# Altium schematic sheet Camera.SchDoc
size A3; Author: Nguyễn Hữu Thắng; DrawnBy: Nguyễn Hữu Thắng; SheetNumber: 30; SheetTotal: 35
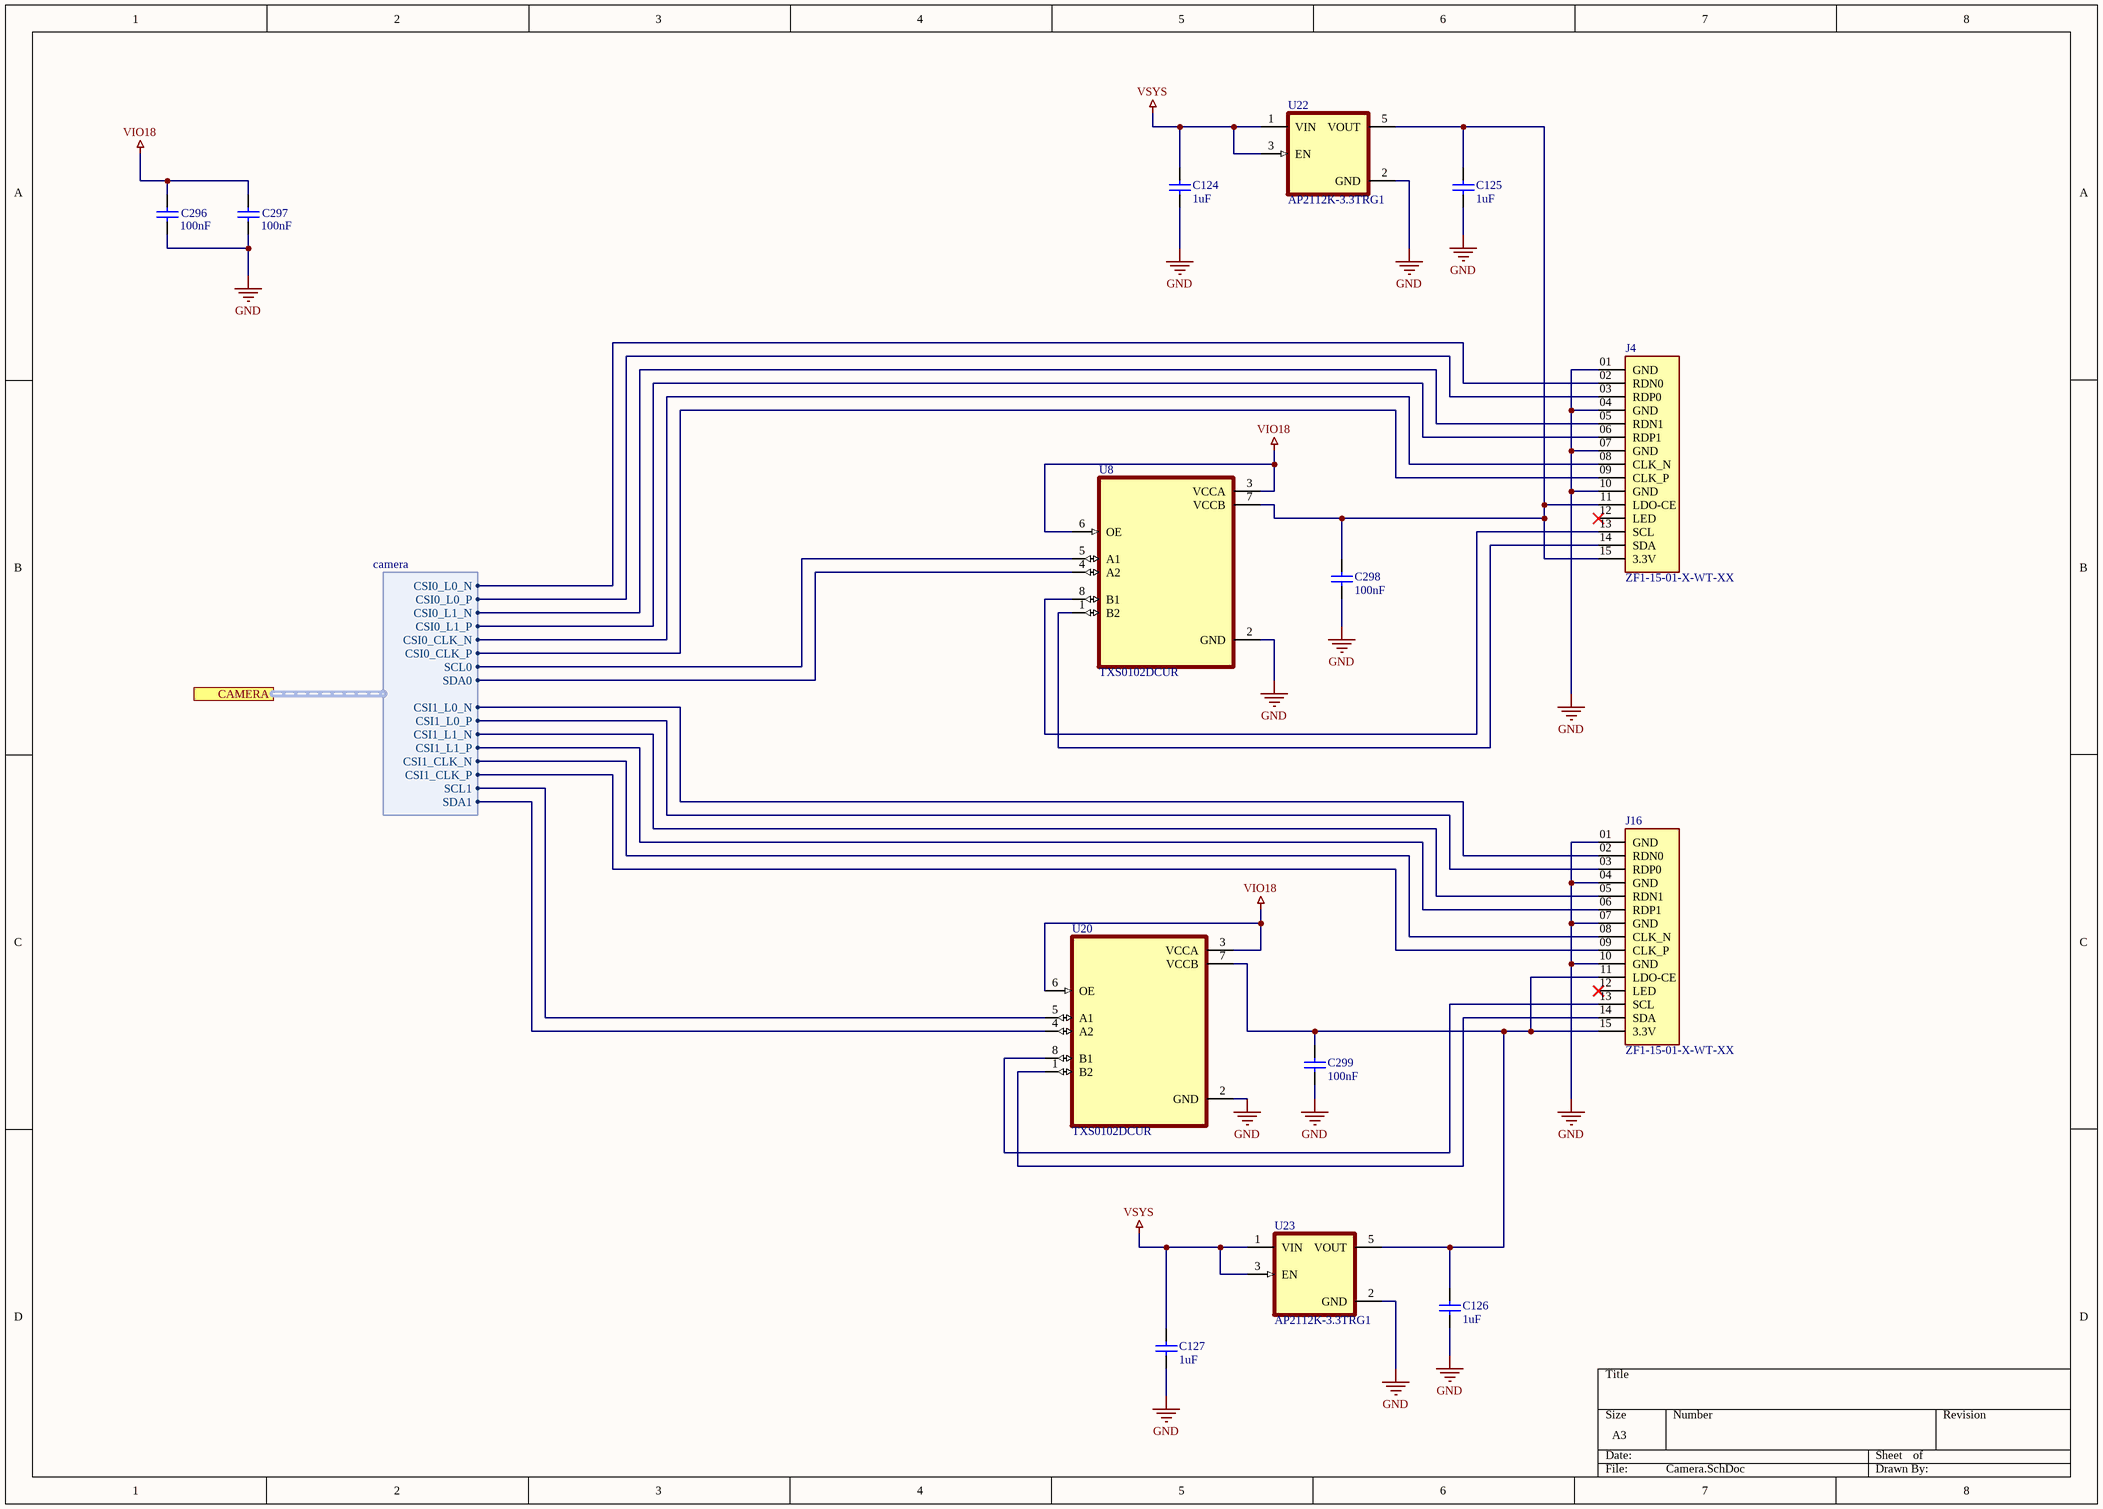
[diagram p0: Camera.SchDoc]

## Parts
C124  value 1uF  [C0805]  (hidden comment: C0805)
C125  value 1uF  [C0805]  (hidden comment: C0805)
C126  value 1uF  [C0805]  (hidden comment: C0805)
C127  value 1uF  [C0805]  (hidden comment: C0805)
C296  value 100nF  [C0603]  (hidden comment: C0603)
C297  value 100nF  [C0603]  (hidden comment: C0603)
C298  value 100nF  [C0603]  (hidden comment: C0603)
C299  value 100nF  [C0603]  (hidden comment: C0603)
J4  ZF1-15-01-X-WT-XX  [SAMTEC_ZF1-15-01-X-WT-XX]
J16  ZF1-15-01-X-WT-XX  [SAMTEC_ZF1-15-01-X-WT-XX]
U8  TXS0102DCUR  [SOP50P310X90-8N]
U20  TXS0102DCUR  [SOP50P310X90-8N]
U22  AP2112K-3.3TRG1  [SOT95P285X140-5N]
U23  AP2112K-3.3TRG1  [SOT95P285X140-5N]

## Ports
CAMERA (harness camera, see main[4000,5400], MT8365[10400,6600], MT8365_Camera[2400,4000])

## Harnesses
camera: CSI0_L0_P, CSI0_L0_N, CSI0_L1_P, CSI0_L1_N, CSI0_CLK_P, CSI0_CLK_N, CSI1_L0_P, CSI1_L0_N, CSI1_L1_P, CSI1_L1_N, CSI1_CLK_P, CSI1_CLK_N, SCL0, SDA0, SCL1, SDA1

## Nets
GND: C124.1 C125.1 C126.1 C127.1 C296.1 C297.1 C298.1 C299.1 J4.01(GND) J4.04(GND) J4.07(GND) J4.10(GND) J16.01(GND) J16.04(GND) J16.07(GND) J16.10(GND) U8.2(GND) U20.2(GND) U22.2(GND) U23.2(GND)
VIO18: C296.2 C297.2 U8.3(VCCA) U8.6(OE) U20.3(VCCA) U20.6(OE)
VSYS: C124.2 C127.2 U22.1(VIN) U22.3(EN) U23.1(VIN) U23.3(EN)
NetC125_2: C125.2 C298.2 J4.11(LDO-CE) J4.15(3.3V) U8.7(VCCB) U22.5(VOUT)
NetC126_2: C126.2 C299.2 J16.11(LDO-CE) J16.15(3.3V) U20.7(VCCB) U23.5(VOUT)
NetJ4_02: J4.02(RDN0) ; port CAMERA.CSI0_L0_N
NetJ4_03: J4.03(RDP0) ; port CAMERA.CSI0_L0_P
NetJ4_05: J4.05(RDN1) ; port CAMERA.CSI0_L1_N
NetJ4_06: J4.06(RDP1) ; port CAMERA.CSI0_L1_P
NetJ4_08: J4.08(CLK_N) ; port CAMERA.CSI0_CLK_N
NetJ4_09: J4.09(CLK_P) ; port CAMERA.CSI0_CLK_P
NetJ4_13: J4.13(SCL) U8.8(B1)
NetJ4_14: J4.14(SDA) U8.1(B2)
NetJ16_02: J16.02(RDN0) ; port CAMERA.CSI1_L0_N
NetJ16_03: J16.03(RDP0) ; port CAMERA.CSI1_L0_P
NetJ16_05: J16.05(RDN1) ; port CAMERA.CSI1_L1_N
NetJ16_06: J16.06(RDP1) ; port CAMERA.CSI1_L1_P
NetJ16_08: J16.08(CLK_N) ; port CAMERA.CSI1_CLK_N
NetJ16_09: J16.09(CLK_P) ; port CAMERA.CSI1_CLK_P
NetJ16_13: J16.13(SCL) U20.8(B1)
NetJ16_14: J16.14(SDA) U20.1(B2)
NetU8_4: U8.4(A2) ; port CAMERA.SDA0
NetU8_5: U8.5(A1) ; port CAMERA.SCL0
NetU20_4: U20.4(A2) ; port CAMERA.SDA1
NetU20_5: U20.5(A1) ; port CAMERA.SCL1

Not connected (* = marked no-connect by the designer): J4 12(LED)*; J16 12(LED)*

## Library data of the parts
U22 U23 = AP2112K-3.3TRG1: Linear Voltage Regulator IC Positive Fixed 1 Output 600mA SOT-25